# EAGLE design Headphone-Amplifier-ClassAB-long (EAGLE 7.6.0)
4x4 - Three Transistor Headphone Amplifier - Class AB http://www.electronics-diy.com/4x4.php
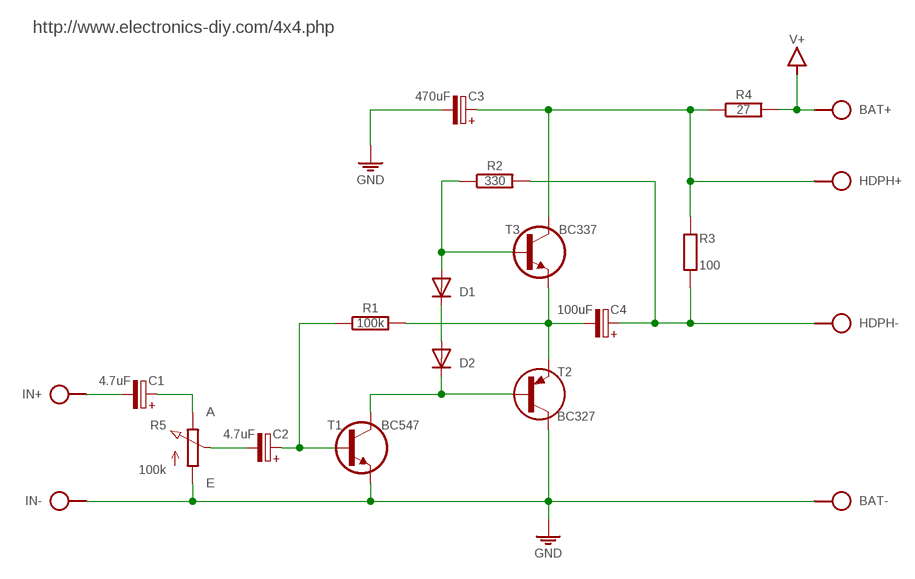
[diagram p0: schematic, sheet 1]

## Parts
BAT  SPAD+-+-  [SPAD+-]
C1  4.7uF  CPOL-HE2,5-4  [E2,5-4]
C2  4.7uF  CPOL-HE2,5-4  [E2,5-4]
C3  470uF  CPOL-HE5-5/V  [E5-5/V]
C4  100uF  CPOL-HE5-4  [E5-4]
D1  1N414834-5V  [DO34-5V]
D2  1N414834-5V  [DO34-5V]
HDPH  SPAD+--+  [SPAD-+]
IN  SPAD+--+  [SPAD-+]
R1  100k  R-H0202/7  [0202/7]
R2  330  R-H0202/7  [0202/7]
R3  100  R0202/7  [0202/7]
R4  27  R-H0204/2V  [0204/2V]
R5  100k  POT-3P  [CONN-3P]
T1  BC547  BC547CBE  [TO92-CBE]
T2  BC327  [TO92]
T3  BC337  BC337CBE  [TO92-CBE]

## Nets
GND: BAT.1 C3.- IN.1 R5.1(A) T1.E T2.1(C)
N$1: D1.A R2.1 T3.B
N$2: D2.C T1.C T2.2(B)
N$3: D1.C D2.A
N$4: C4.- R1.2 T2.3(E) T3.E
N$5: C1.+ R5.3(E)
N$6: C2.- R5.2(S)
N$7: C2.+ R1.1 T1.B
N$8: C3.+ HDPH.2 R3.1 R4.1 T3.C
N$9: C4.+ HDPH.1 R2.2 R3.2
N$10: C1.- IN.2
V+: BAT.2 R4.2

## Notes on the sheet
- http://www.electronics-diy.com/4x4.php

## Library data of the parts
BAT HDPH IN = pad:SPAD+-
C1-C4 = c:CPOL-H
D1 D2 = d:1N4148
R1 R2 R4 = r:R-H
R3 = r:R: RESISTOR, European symbol
R5 = r:POT
T1 = t:BC547
T2 = t:BC327
T3 = t:BC337

## Net classes
0 default: width 0.61 mm

## Board
4x4 - Three Transistor Headphone Amplifier - Class AB http://www.electronics-diy.com/4x4.php
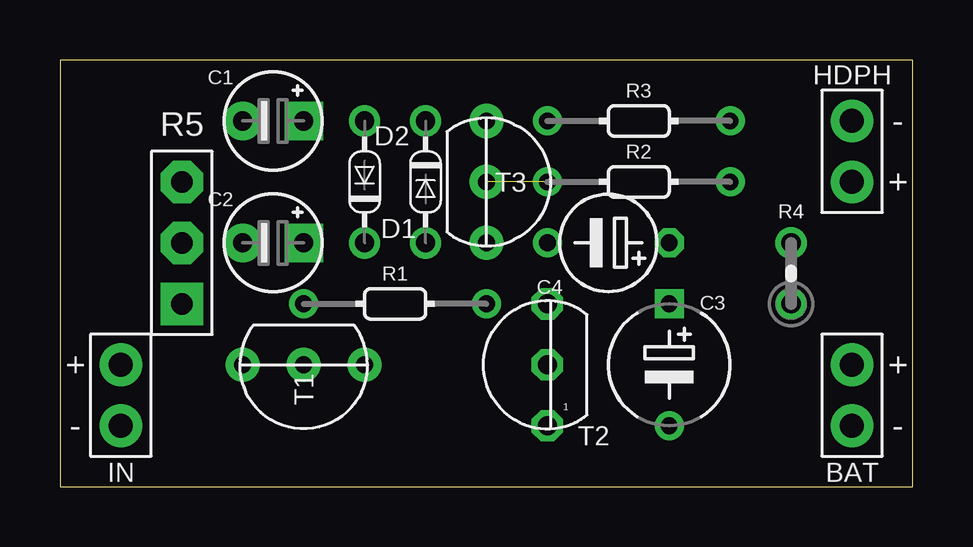
[diagram p1: board, top side]
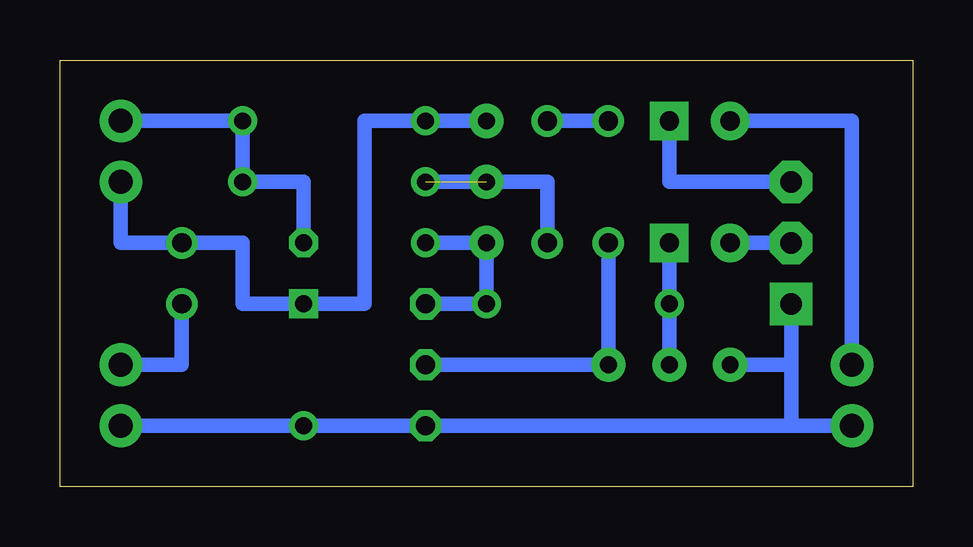
[diagram p2: board, bottom side, seen from below]

Size 35.56 x 17.78 mm. Coordinates in mm from the lower left corner, seen from the top.
Outline: 0,0 35.56,0 35.56,17.78 0,17.78 0,0
Copper layers (1*16): Top 0.035mm / dielectric 1.5mm / Bottom 0.035mm
Design rules "default": minimum track width 10mil, minimum drill 24mil, track to track 8mil, track to pad 8mil, pad to pad 8mil, via to via 8mil, smd to smd 8mil, copper to edge 40mil, drill to drill 8mil, minimum pad ring 10mil, minimum via ring 8mil, stop-mask expansion 4mil, vias tented up to drill 0mil, thermal gap 10mil

### Footprints (pad centres in the part's own frame; a part is rotated, then mirrored left to right if it is on the bottom)
SPAD+- = drill 1 pad 1.778: 1 0,-1.27; 2 0,1.27
E2,5-4 = drill 0.8 pad 1.6 square: + 1.27,0 | drill 0.8 pad 1.6: - -1.27,0
E5-5/V = drill 0.7 square: + 0,2.54 | drill 0.7: - 0,-2.54
E5-4 = drill 0.7 octagon: + -2.54,0 | drill 0.7: - 2.54,0
DO34-5V = drill 0.8: A 0,2.54; C 0,-2.54
SPAD-+ = drill 1 pad 1.778: 1 0,-1.27; 2 0,1.27
0202/7 = drill 0.7: 1 -3.81,0; 2 3.81,0
0204/2V = drill 0.8: 1 0,1.27; 2 0,-1.27
CONN-3P = drill 0.9 pad 1.778 square: 1 0,-2.54 | drill 0.9 pad 1.778 octagon: 2 0,0; 3 0,2.54
TO92-CBE = drill 0.7 pad 1.422: B 0,0; C 0,2.54; E 0,-2.54
TO92 = drill 0.8 octagon: 1 0,2.54; 2 0,0; 3 0,-2.54

### Placement (x,y rotation side)
BAT  33.02,3.81 0 top
C1  8.89,15.24 0 top
C2  8.89,10.16 0 top
C3  25.4,5.08 0 top
C4  22.86,10.16 180 top
D1  15.24,12.7 180 top
D2  12.7,12.7 0 top
HDPH  33.02,13.97 180 top
IN  2.54,3.81 0 top
R1  13.97,7.62 0 top
R2  24.13,12.7 0 top
R3  24.13,15.24 0 top
R4  30.48,8.89 0 top
R5  5.08,10.16 0 top
T1  10.16,5.08 270 top
T2  20.32,5.08 180 top
T3  17.78,12.7 0 top

### Tracks (layer width: path | path; a pad name or v marks a point on that pad's centre or on a via)
GND
  Bottom 0.61: 5.08,2.54 IN.1 T2.1 C3.- BAT.1 | 7.62,2.54 5.08,2.54 | 5.08,2.54 5.08,5.08 | T1.E 5.08,5.08 | 5.08,5.08 R5.1
N$1  (1 unrouted)
  Bottom 0.61: R2.1 15.24,12.7 D1.A
N$2
  Bottom 0.61: T2.2 T1.C D2.C
N$3
  Bottom 0.61: D2.A D1.C
N$4
  Bottom 0.61: C4.- T3.E R1.2 T2.3
N$5
  Bottom 0.61: R5.3 10.16,12.7 C1.+
N$6
  Bottom 0.61: C2.- R5.2
N$7
  Bottom 0.61: C2.+ R1.1 T1.B
N$8
  Bottom 0.61: T3.C R3.1 22.86,15.24 22.86,7.62 C3.+ 27.94,7.62 27.94,10.16 R4.1 33.02,10.16 HDPH.2
N$9
  Bottom 0.61: C4.+ 25.4,12.7 R2.2 R3.2 HDPH.1
N$10
  Bottom 0.61: IN.2 2.54,15.24 C1.-
V+
  Bottom 0.61: BAT.2 30.48,5.08 R4.2